# EAGLE design Prototyp-V-0.2 (EAGLE 6.6.0)
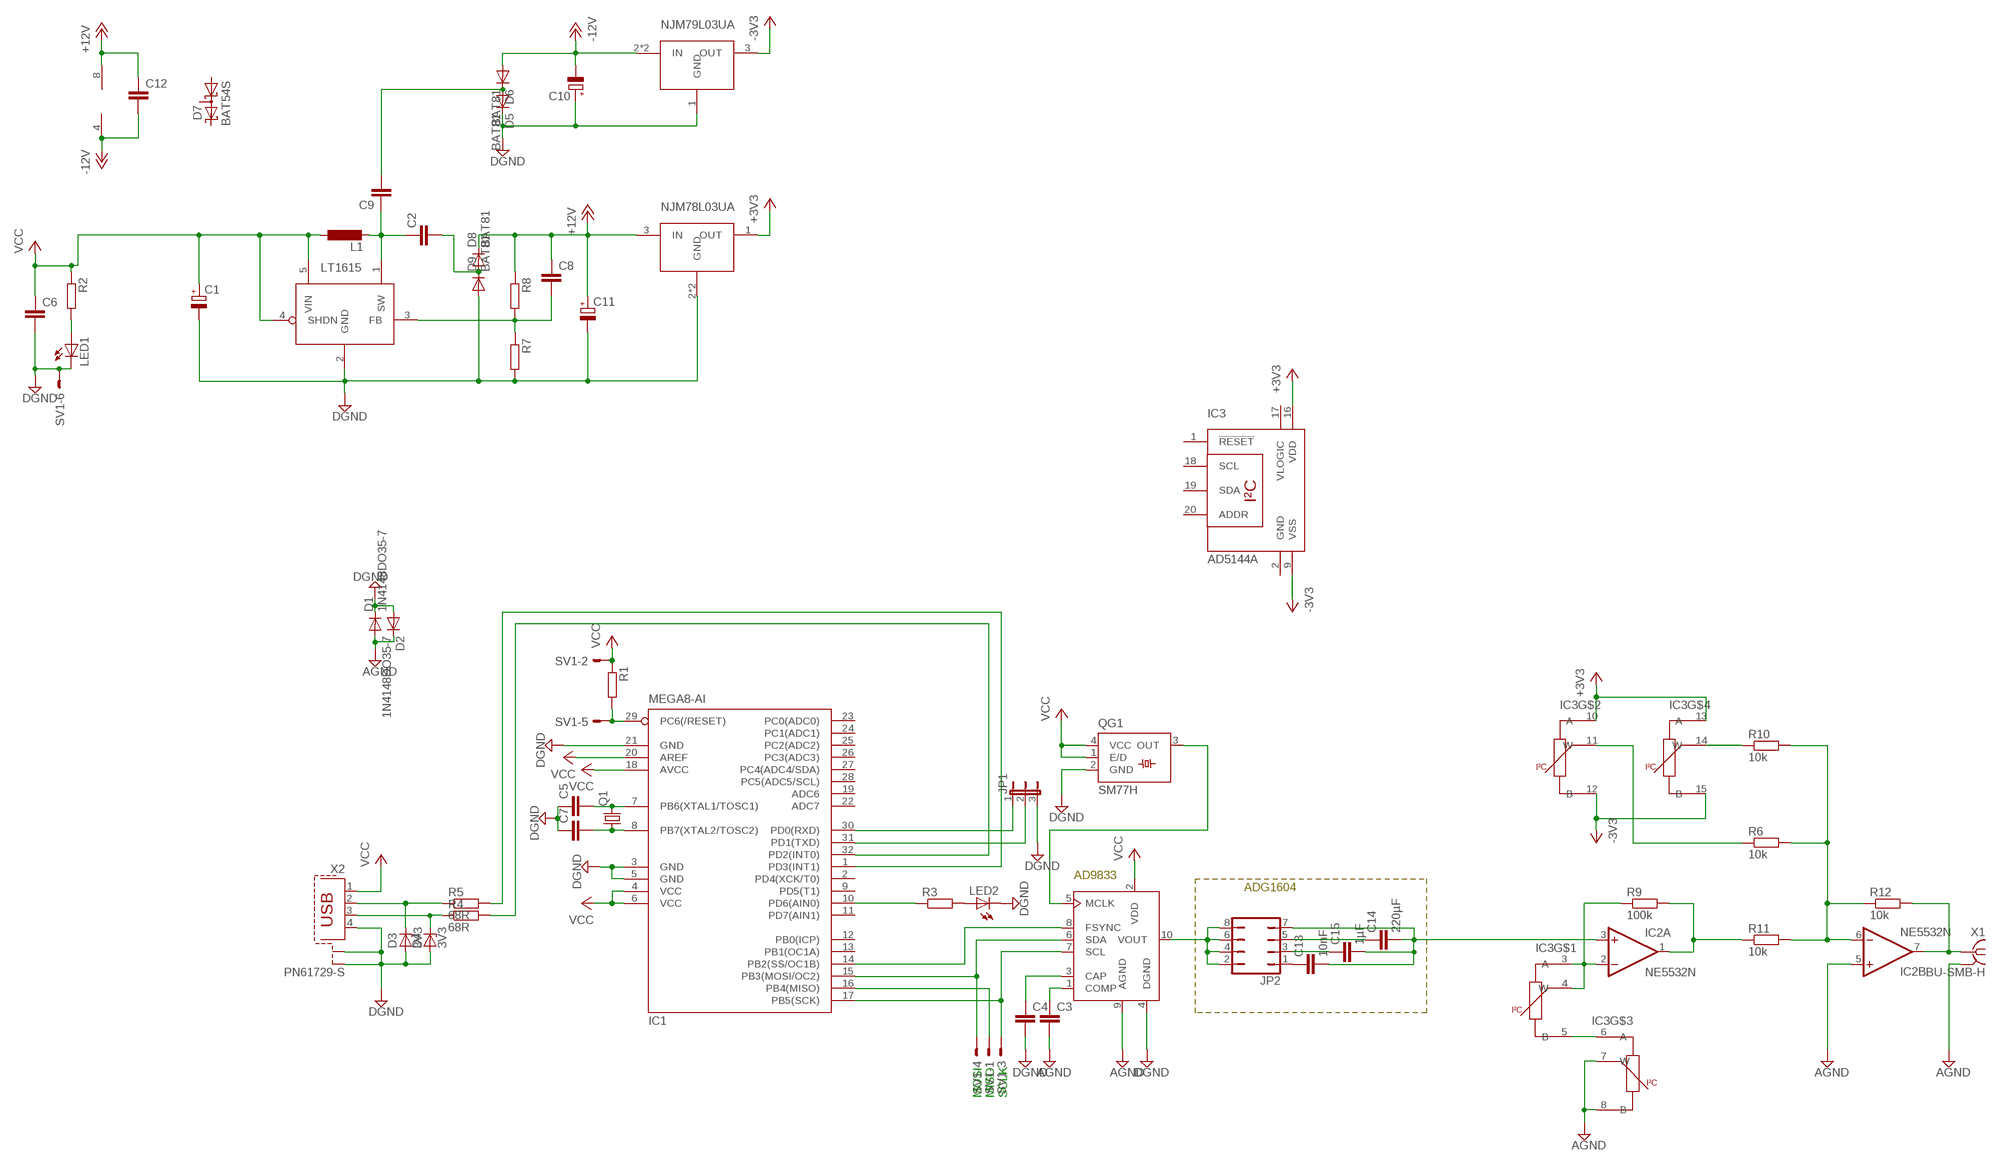
[diagram p0: schematic, sheet 1]

## Parts
C1  CPOL-EUE3.5-8  [E3,5-8]
C2  C-EU025-024X044  [C025-024X044]
C3  C-EU025-024X044  [C025-024X044]
C4  C-EU025-024X044  [C025-024X044]
C5  C-EU025-024X044  [C025-024X044]
C6  C-EU025-024X044  [C025-024X044]
C7  C-EU025-024X044  [C025-024X044]
C8  C-EU025-024X044  [C025-024X044]
C9  C-EU025-024X044  [C025-024X044]
C10  CPOL-EUE3.5-8  [E3,5-8]
C11  CPOL-EUE3.5-8  [E3,5-8]
C12  C-EU025-024X044  [C025-024X044]
C13  10nF  C-EU025-024X044  [C025-024X044]
C14  220µF  C-EU025-024X044  [C025-024X044]
C15  1µF  C-EU025-024X044  [C025-024X044]
D1  1N4148DO35-7  [DO35-7]
D2  1N4148DO35-7  [DO35-7]
D3  3V3  ZENER-DIODEZD-7.5  [ZDIO-7.5]
D4  3V3  ZENER-DIODEZD-7.5  [ZDIO-7.5]
D5  BAT81  [DO34-7]
D6  BAT81  [DO34-7]
D7  BAT54S  [SOT23]
D8  BAT81  [DO34-7]
D9  BAT81  [DO34-7]
IC1  MEGA8-AI  [TQFP32-08]
IC2  NE5532N  [DIL08]
IC3  AD5144A  [TSSOP20]
JP1  JP2E  [JP2]
JP2  JP4Q  [JP4Q]
L1  L-EU0207/10  [0207/10]
LED1  LED5MM  [LED5MM]
LED2  LED5MM  [LED5MM]
Q1  CRYSTALSM77H  [SM77H]
QG1  SM77H  [SM77H]
R1  R-EU_0207/10  [0207/10]
R2  R-EU_0207/10  [0207/10]
R3  R-EU_0207/10  [0207/10]
R4  68R  R-EU_0207/10  [0207/10]
R5  68R  R-EU_0207/10  [0207/10]
R6  10k  R-EU_0207/10  [0207/10]
R7  R-EU_0207/10  [0207/10]
R8  R-EU_0207/10  [0207/10]
R9  100k  R-EU_0207/10  [0207/10]
R10  10k  R-EU_0207/10  [0207/10]
R11  10k  R-EU_0207/10  [0207/10]
R12  10k  R-EU_0207/10  [0207/10]
SV1  ML6E  [ML6]
U$1  AD9833-P  [DIL10]
U$2  LT1615  [SOT23-5]
U$3  NJM79L03UA  [SOT89]
U$4  NJM78L03UA  [SOT89]
X1  BU-SMB-H  [BU-SMB-H]
X2  PN61729-S  [PN61729-S]

## Nets
+3V3: IC3.10(A) IC3.13(A) IC3.16(VDD) U$4.1(OUT)
+12V: C8.1 C11.+ C12.1 D8.C IC2.8(P:V+) R8.1 U$4.3(IN)
-3V3: IC3.9(VSS) IC3.12(B) IC3.15(B) U$3.3(OUT)
-12V: C10.- C12.2 D6.A IC2.4(P:V-) U$3.2(IN) U$3.2@1(IN)
AGND: C3.2 D1.A D2.C IC2.5(B:+IN) IC3.7(W) IC3.8(B) U$1.9(AGND) X1.2 X1.3 X1.4 X1.5
DGND: C1.- C4.2 C5.1 C6.2 C7.1 C10.+ C11.- D1.C D2.A D3.A D4.A D5.C D9.A IC1.3(GND) IC1.5(GND) IC1.21(GND) JP1.3 LED1.K(C) LED2.K(C) QG1.2(GND) R7.2 SV1.6 U$1.4(DGND) U$2.2(GND) U$3.1(GND) U$4.2(GND) U$4.2@1(GND) X2.4 X2.S1 X2.S2
N$1: C5.2 IC1.7(PB6(XTAL1/TOSC1)) Q1.3
N$2: C7.2 IC1.8(PB7(XTAL2/TOSC2)) Q1.1
N$3: C3.1 U$1.1(COMP)
N$4: IC1.17(PB5(SCK)) SV1.3 U$1.7(SCL)
N$5: IC1.29(PC6(/RESET)) R1.2 SV1.5
N$6: IC1.15(PB3(MOSI/OC2)) SV1.4 U$1.6(SDA)
N$7: IC1.14(PB2(SS/OC1B)) U$1.8(FSYNC)
N$8: IC1.16(PB4(MISO)) SV1.1
N$9: C4.1 U$1.3(CAP)
N$10: IC1.10(PD6(AIN0)) R3.1
N$11: QG1.3(OUT) U$1.5(MCLK)
N$12: IC1.32(PD2(INT0)) R4.2
N$13: IC1.1(PD3(INT1)) R5.2
N$14: D3.C R5.1 X2.2
N$15: D4.C R4.1 X2.3
N$16: IC1.30(PD0(RXD)) JP1.1
N$17: LED1.A R2.2
N$18: LED2.A R3.2
N$19: IC1.31(PD1(TXD)) JP1.2
N$20: C8.2 R7.1 R8.2 U$2.3(FB)
N$21: JP2.2 JP2.4 JP2.6 JP2.8 U$1.10(VOUT)
N$22: C9.2 D5.A D6.C
N$23: C2.1 C9.1 L1.2 U$2.1(SW)
N$24: C14.1 JP2.5
N$25: C2.2 D8.A D9.C
N$26: C13.1 JP2.1
N$27: IC2.2(A:-IN) IC3.3(A) IC3.4(W) R9.1
N$28: C13.2 C14.2 C15.2 IC2.3(A:+IN) JP2.7
N$29: IC2.1(A:OUT) R9.2 R11.1
N$30: IC2.6(B:-IN) R6.2 R10.2 R11.2 R12.1
N$31: IC2.7(B:OUT) R12.2 X1.1
N$32: C15.1 JP2.3
N$33: IC3.5(B) IC3.6(A)
N$34: IC3.14(W) R10.1
N$35: IC3.11(W) R6.1
VCC: C1.+ C6.1 IC1.4(VCC) IC1.6(VCC) IC1.18(AVCC) IC1.20(AREF) L1.1 QG1.1(E/D) QG1.4(VCC) R1.1 R2.1 SV1.2 U$1.2(VDD) U$2.4(SHDN) U$2.5(VIN) X2.1
Unconnected: D7.1(A1) D7.2(C2) D7.3(C1A2) IC1.2(PD4(XCK/T0)) IC1.9(PD5(T1)) IC1.11(PD7(AIN1)) IC1.12(PB0(ICP)) IC1.13(PB1(OC1A)) IC1.19(ADC6) IC1.22(ADC7) IC1.23(PC0(ADC0)) IC1.24(PC1(ADC1)) IC1.25(PC2(ADC2)) IC1.26(PC3(ADC3)) IC1.27(PC4(ADC4/SDA)) IC1.28(PC5(ADC5/SCL)) IC3.1(!RESET) IC3.2(GND) IC3.17(VLOGIC) IC3.18(SCL) IC3.19(SDA) IC3.20(ADDR)

## Notes on the sheet
- AD9833
- ADG1604
- MOSI
  MISO
  SCLK

## Library data of the parts
C1 C10 C11 = rcl:CPOL-EU: POLARIZED CAPACITOR, European symbol
C2-C9 C12-C15 = rcl:C-EU: CAPACITOR, European symbol
D1 D2 = diode:1N4148: DIODE high speed (Philips)
D3 D4 = diode:ZENER-DIODE: Z-Diode
D5 D6 D8 D9 = diode:BAT81: DIODE barrier diode
D7 = diode:BAT54S: Schottky Diodes Pin connection corrected 2011-05-04 Source: Fairchild .. BAT54.pdf
IC1 = atmel:MEGA8: MICROCONTROLLER 8 Kbytes FLASH, 1 kbytes SRAM, 512 bytes EEPROM, USART, 6-channel 10 bit ADC, 2-channel 8 bit ADC Pin compatible with Atmega48, ATMega88, ATMega168 Source: avr.lbr; MPN: ATMEGA8-16AU; OC_FARNELL: 9171371; OC_NEWARK: 73M8863
IC2 = linear:NE5532: AUDIO AMPLIFIER
IC3 = analog-devices:AD5144A
JP1 = jumper:JP2E: JUMPER
JP2 = jumper:JP4Q: JUMPER
L1 = rcl:L-EU: INDUCTOR, European symbol
LED1 LED2 = led:LED: LED OSRAM: - CHIPLED LG R971, LG N971, LY N971, LG Q971, LY Q971, LO R971, LY R971 LH N974, LH R974 LS Q976, LO Q976, LY Q976 LO Q996 - Hyper CHIPLED LW Q18S LB Q993, LB Q99A, LB R99A - SideLED LS A670, LO A670, LY A670, LG A670, LP A670 LB A673, LV A673, LT A673, LW A673 LH A674 LY A675 LS A676, LA A676, LO A676, LY A676, LW A676 LS A679, LY A679, LG A679 - Hyper Micro SIDELED® LS Y876, LA Y876, LO Y876, LY Y876 LT Y87S - SmartLED LW L88C, LW L88S LB L89C, LB L89S, LG L890 LS L89K, LO L89K, LY L89K LS L896, LA L896, LO L896, LY L896 - TOPLED LS T670, LO T670, LY T670, LG T670, LP T670 LSG T670, LSP T670, LSY T670, LOP T670, LYG T670 LG T671, LOG T671, LSG T671 LB T673, LV T673, LT T673, LW T673 LH T674 LS T676, LA T676, LO T676, LY T676, LB T676, LH T676, LSB T676, LW T676 LB T67C, LV T67C, LT T67C, LS T67K, LO T67K, LY T67K, LW E67C LS E67B, LA E67B, LO E67B, LY E67B, LB E67C, LV E67C, LT E67C LW T67C LS T679, LY T679, LG T679 LS T770, LO T770, LY T770, LG T770, LP T770 LB T773, LV T773, LT T773, LW T773 LH T774 LS E675, LA E675, LY E675, LS T675 LS T776, LA T776, LO T776, LY T776, LB T776 LHGB T686 LT T68C, LB T68C - Hyper Mini TOPLED® LB M676 - Mini TOPLED Santana® LG M470 LS M47K, LO M47K, LY M47K Source: http://www.osram.convergy.de LUXEON: - LUMILED® LXK2-PW12-R00, LXK2-PW12-S00, LXK2-PW14-U00, LXK2-PW14-V00 LXK2-PM12-R00, LXK2-PM12-S00, LXK2-PM14-U00 LXK2-PE12-Q00, LXK2-PE12-R00, LXK2-PE12-S00, LXK2-PE14-T00, LXK2-PE14-U00 LXK2-PB12-K00, LXK2-PB12-L00, LXK2-PB12-M00, LXK2-PB14-N00, LXK2-PB14-P00, LXK2-PB14-Q00 LXK2-PR12-L00, LXK2-PR12-M00, LXK2-PR14-Q00, LXK2-PR14-R00 LXK2-PD12-Q00, LXK2-PD12-R00, LXK2-PD12-S00 LXK2-PH12-R00, LXK2-PH12-S00 LXK2-PL12-P00, LXK2-PL12-Q00, LXK2-PL12-R00 Source: www.luxeon.com KINGBRIGHT: KA-3528ASYC Source: www.kingbright.com
Q1 = crystal:CRYSTAL: CRYSTAL
QG1 = crystal:SM77H: 3.3V CMOS Clock Oscillator Source: www.pletronics.com .. sm77h%203.3v.pdf; OC_FARNELL: unknown; OC_NEWARK: unknown
R1-R12 = rcl:R-EU_: RESISTOR, European symbol
SV1 = con-harting-ml:ML6?E: HARTING; OC_FARNELL: unknown; OC_NEWARK: unknown
U$1 = analog-devices:AD9833: AD9833 DDS-IC Information: analog.com
U$2 = linear:LT1615
U$3 U$4 = linear:NJM7
X1 = con-coax:BU-SMB-H: FEMALE SMB CONNECTOR Radiall distributor RS 112-3003; OC_FARNELL: unknown; OC_NEWARK: unknown
X2 = con-berg:PN61729-S: BERG USB connector; OC_FARNELL: unknown; OC_NEWARK: unknown

## Board
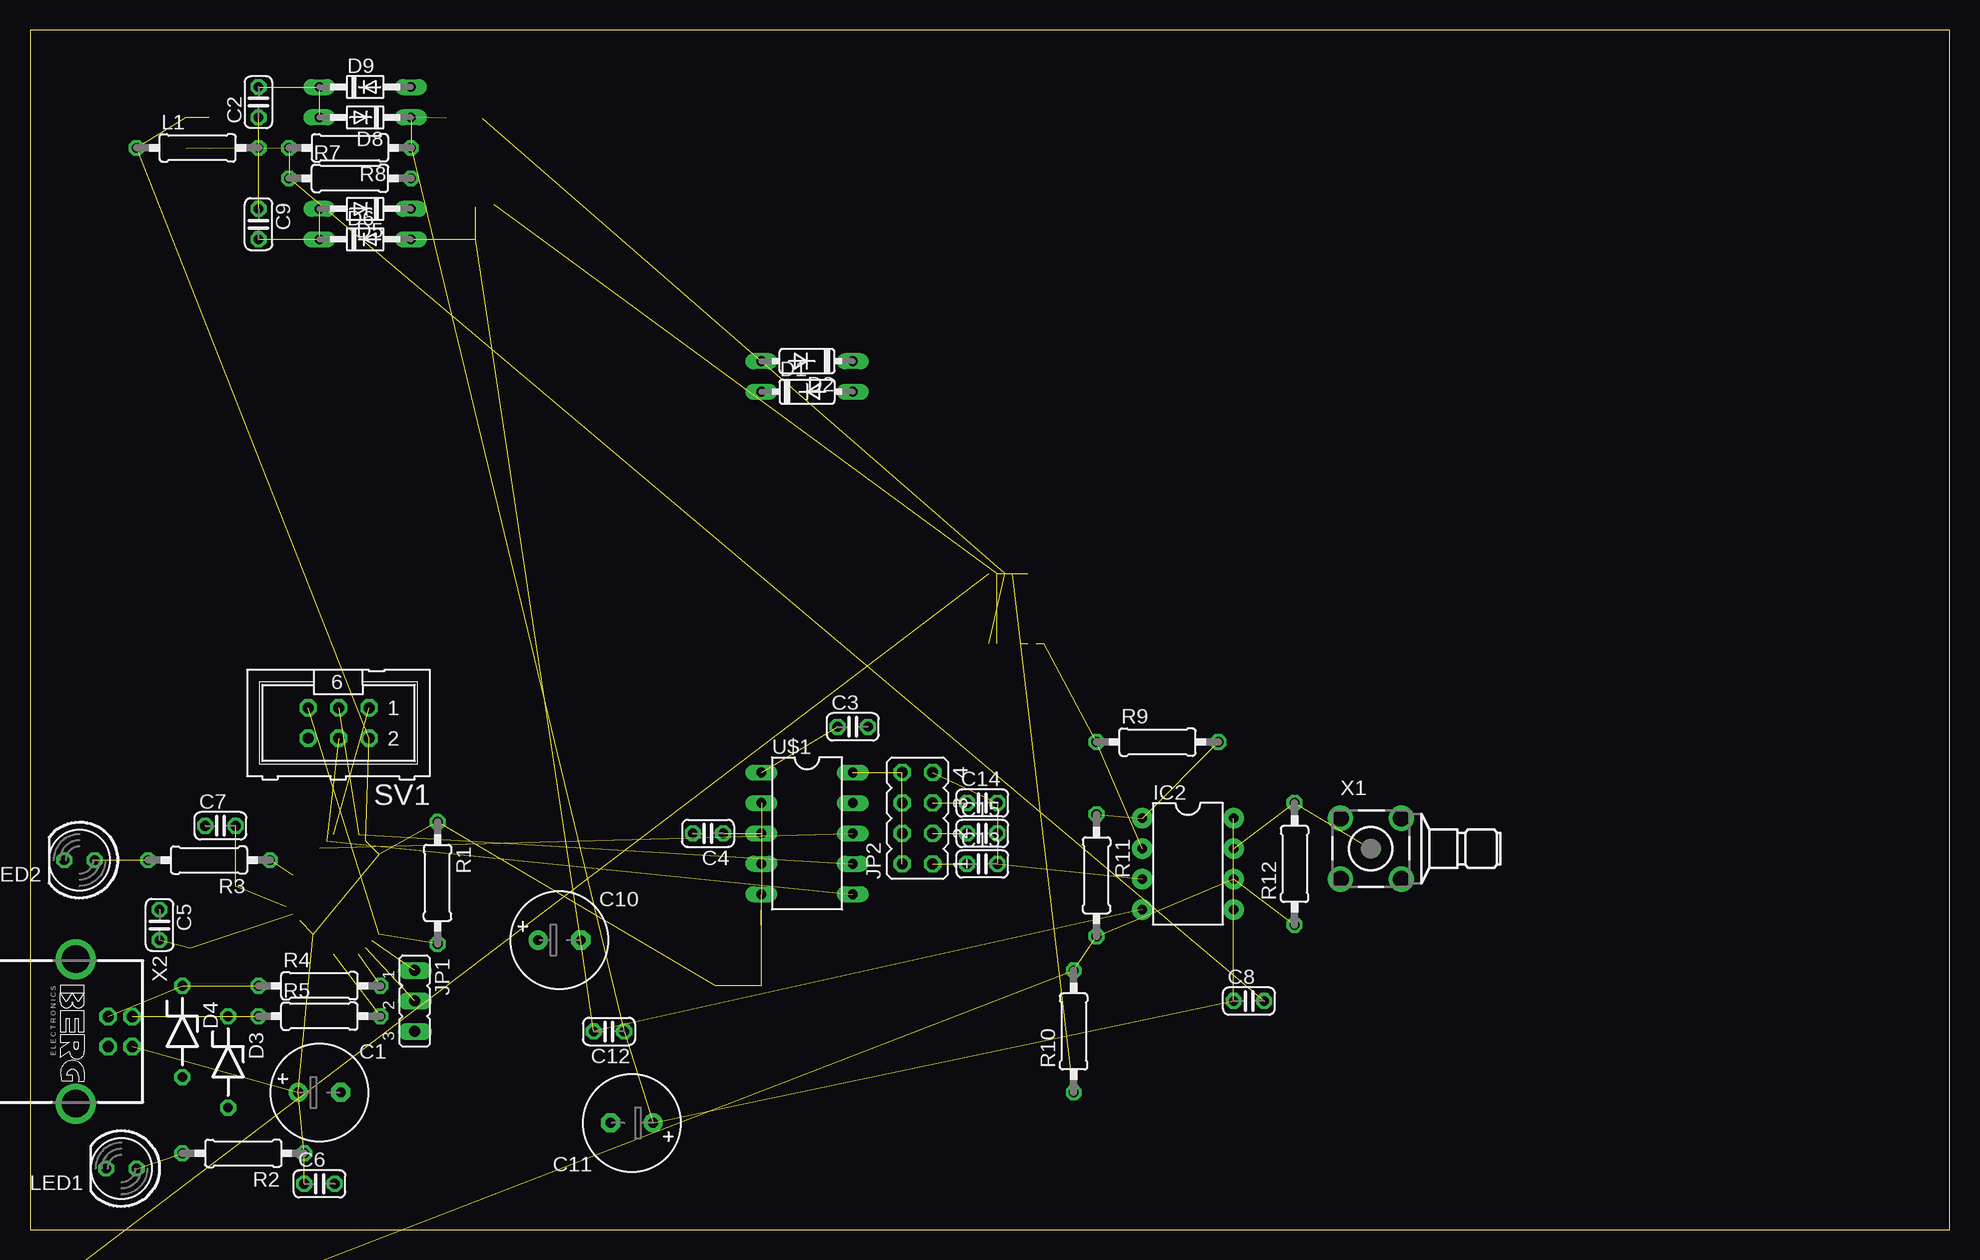
[diagram p1: board, top side]
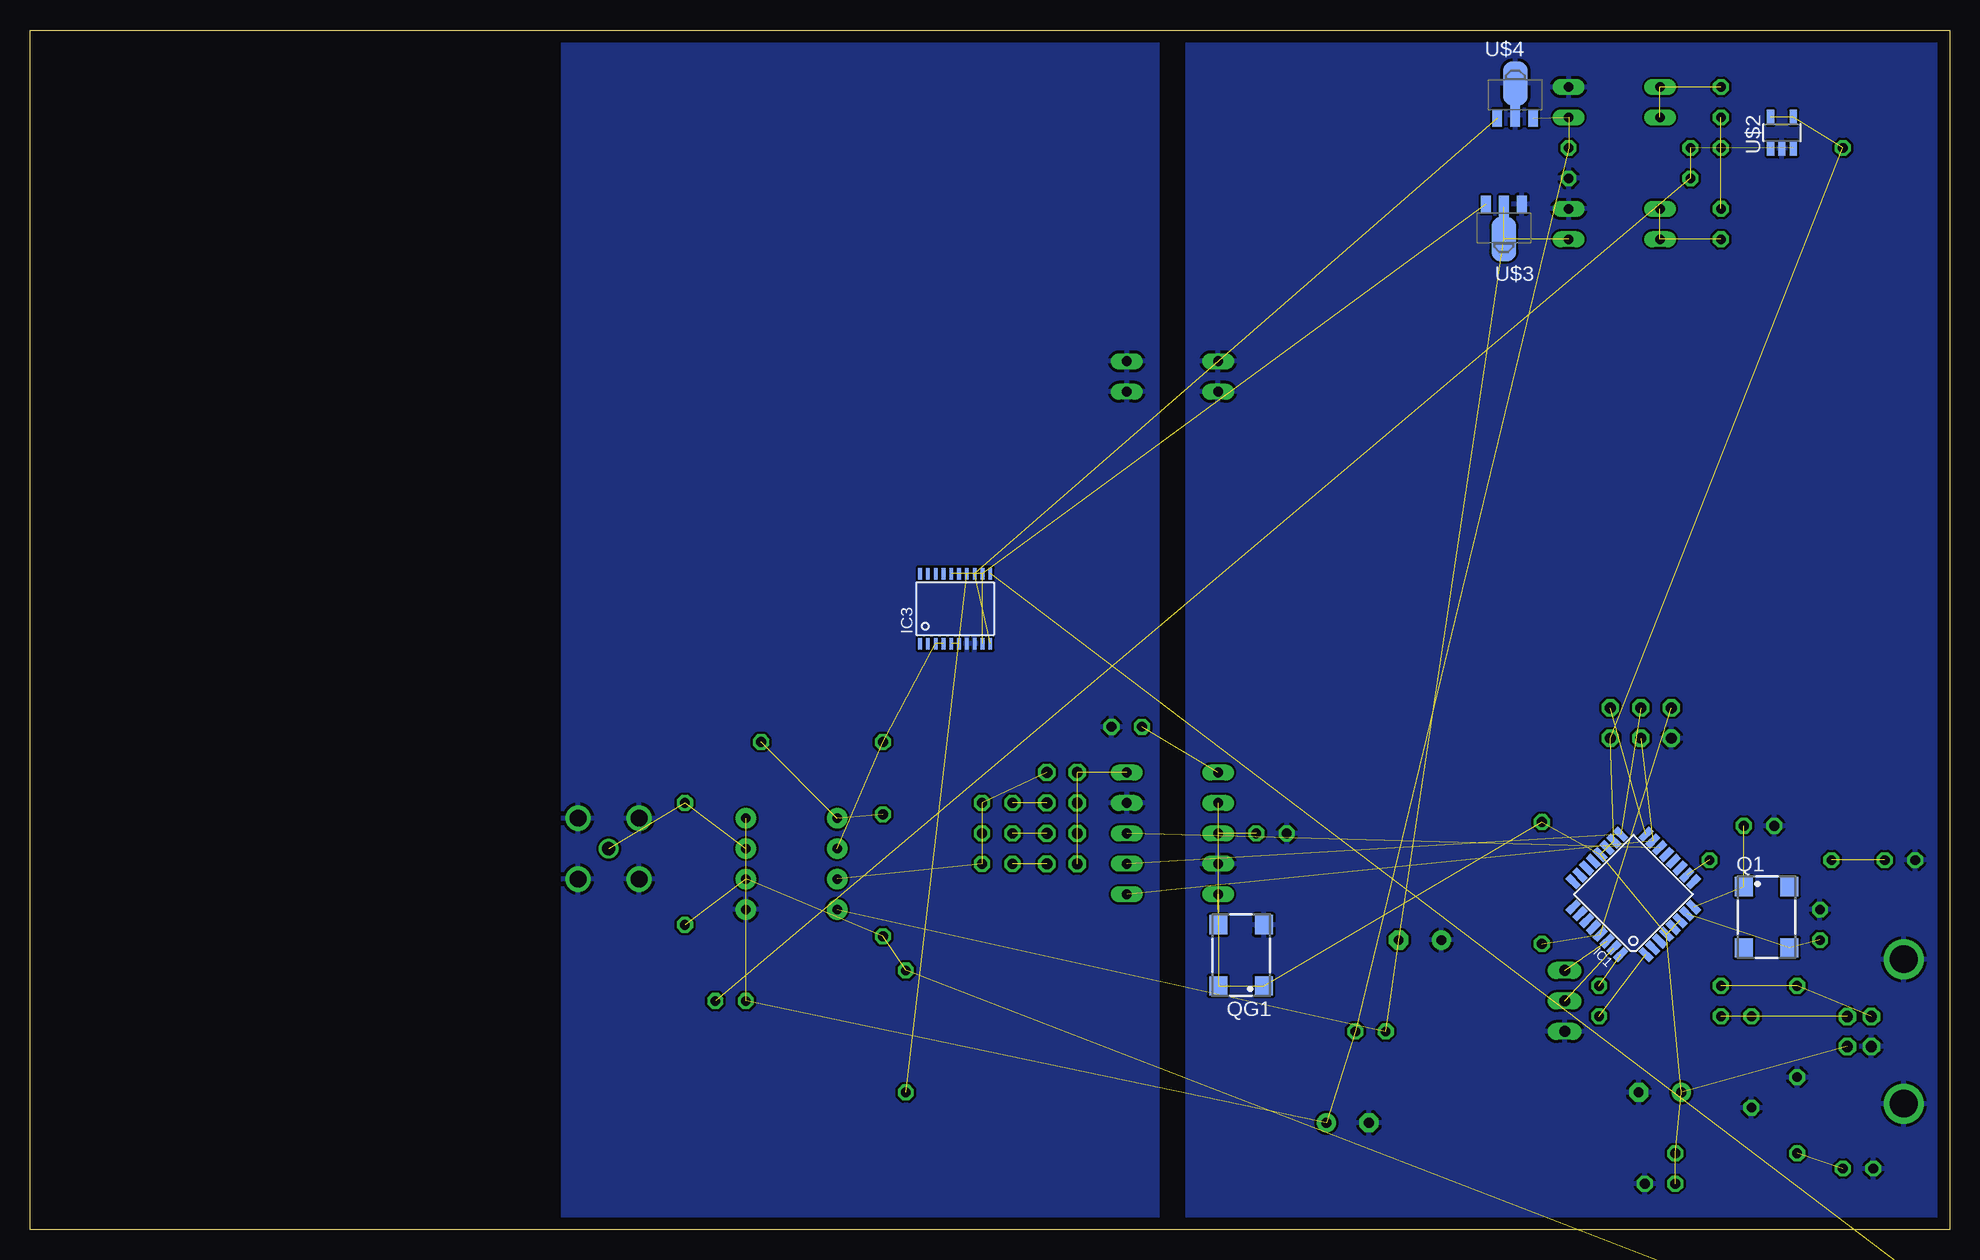
[diagram p2: board, bottom side, seen from below]

Size 160 x 100 mm. Coordinates in mm from the lower left corner, seen from the top.
Outline: 0,0 160,0 160,100 0,100 0,0
Copper layers (1*16): Top 0.035mm / dielectric 1.5mm / Bottom 0.035mm
Design rules "default": minimum track width 10mil, minimum drill 24mil, track to track 8mil, track to pad 8mil, pad to pad 8mil, via to via 8mil, smd to smd 8mil, copper to edge 40mil, drill to drill 8mil, minimum pad ring 10mil, minimum via ring 8mil, stop-mask expansion 4mil, vias tented up to drill 0mil, thermal gap 10mil

### Footprints (pad centres in the part's own frame; a part is rotated, then mirrored left to right if it is on the bottom)
E3,5-8 = drill 0.813 pad 1.6: + -1.778,0 | drill 0.813 pad 1.6 octagon: - 1.778,0
C025-024X044 = drill 0.813 octagon: 1 -1.27,0; 2 1.27,0
DO35-7 = drill 0.813 long: A 3.81,0; C -3.81,0
ZDIO-7.5 = drill 0.813 octagon: A 3.81,0; C -3.81,0
DO34-7 = drill 0.813 long: A 3.81,0; C -3.81,0
SOT23 = smd 1 x 1.4: 1 -0.95,-1.1; 2 0.95,-1.1; 3 0,1.1
TQFP32-08 = smd 1.27 x 0.559: 1 -4.293,2.8; 2 -4.293,2; 3 -4.293,1.2; 4 -4.293,0.4; 5 -4.293,-0.4; 6 -4.293,-1.2; 7 -4.293,-2; 8 -4.293,-2.8; 17 4.293,-2.8; 18 4.293,-2; 19 4.293,-1.2; 20 4.293,-0.4; 21 4.293,0.4; 22 4.293,1.2; 23 4.293,2; 24 4.293,2.8 | smd 0.559 x 1.27: 9 -2.8,-4.293; 10 -2,-4.293; 11 -1.2,-4.293; 12 -0.4,-4.293; 13 0.4,-4.293; 14 1.2,-4.293; 15 2,-4.293; 16 2.8,-4.293; 25 2.8,4.293; 26 2,4.293; 27 1.2,4.293; 28 0.4,4.293; 29 -0.4,4.293; 30 -1.2,4.293; 31 -2,4.293; 32 -2.8,4.293
DIL08 = drill 0.813 pad 1.676: 1 -3.81,-3.81; 2 -1.27,-3.81; 3 1.27,-3.81; 4 3.81,-3.81; 5 3.81,3.81; 6 1.27,3.81; 7 -1.27,3.81; 8 -3.81,3.81
TSSOP20 = smd 0.305 x 0.991: 1 -3.575,-2.918; 2 -2.925,-2.918; 3 -2.275,-2.918; 4 -1.625,-2.918; 5 -0.975,-2.918; 6 -0.325,-2.918; 7 0.325,-2.918; 8 0.975,-2.918; 9 1.625,-2.918; 10 2.275,-2.918; 11 2.275,2.918; 12 1.625,2.918; 13 0.975,2.918; 14 0.325,2.918; 15 -0.325,2.918; 16 -0.975,2.918; 17 -1.625,2.918; 18 -2.275,2.918; 19 -2.925,2.918; 20 -3.575,2.918
JP2 = drill 0.914 long: 1 -2.54,0; 2 0,0; 3 2.54,0
JP4Q = drill 0.914 octagon: 1 -3.81,-1.27; 2 -3.81,1.27; 3 -1.27,-1.27; 4 -1.27,1.27; 5 1.27,-1.27; 6 1.27,1.27; 7 3.81,-1.27; 8 3.81,1.27
0207/10 = drill 0.813 octagon: 1 -5.08,0; 2 5.08,0
LED5MM = drill 0.813 octagon: A -1.27,0; K 1.27,0
SM77H = smd 1.6 x 1.5: 1 -2.55,-1.9; 2 2.55,-1.9; 3 2.55,1.9; 4 -2.55,1.9
ML6 = drill 0.914 octagon: 1 -2.54,-1.27; 2 -2.54,1.27; 3 0,-1.27; 4 0,1.27; 5 2.54,-1.27; 6 2.54,1.27
DIL10 = drill 0.813 long: 1 -5.08,-3.81; 2 -2.54,-3.81; 3 0,-3.81; 4 2.54,-3.81; 5 5.08,-3.81; 6 5.08,3.81; 7 2.54,3.81; 8 0,3.81; 9 -2.54,3.81; 10 -5.08,3.81
SOT23-5 = smd 0.6 x 1.2: 1 -0.95,-1.306; 2 0,-1.306; 3 0.95,-1.306; 4 0.95,1.306; 5 -0.95,1.306
SOT89 = smd 0.8 x 1.4: 1 -1.499,-1.981; 3 1.499,-1.981 | smd 0.8 x 1.9: 2 0,-1.727 | smd 2.032 x 3.65: 2@1 0,0.94
BU-SMB-H = drill 1.1: 1 0,0 | drill 1.4: 2 -2.54,2.54; 3 2.54,2.54; 4 2.54,-2.54; 5 -2.54,-2.54
PN61729-S = drill 0.95 octagon: 1 1.25,4.71; 2 -1.25,4.71; 3 -1.25,2.71; 4 1.25,2.71 | drill 2.3 pad 2.9: S1 -6.02,0; S2 6.02,0

### Placement (x,y rotation side)
C1  24.13,11.43 0 top
C2  19.05,93.98 90 top
C3  68.58,41.91 0 top
C4  56.52,33.02 180 top
C5  10.79,25.4 270 top
C6  24.13,3.81 0 top
C7  15.88,33.66 0 top
C8  101.6,19.05 0 top
C9  19.05,83.82 270 top
C10  44.13,24.13 0 top
C11  50.16,8.89 180 top
C12  48.26,16.51 180 top
C13  79.38,30.48 0 top
C14  79.38,35.56 0 top
C15  79.38,33.02 0 top
D1  64.77,69.85 0 top
D2  64.77,72.39 180 top
D3  16.51,13.97 270 top
D4  12.7,16.51 270 top
D5  27.94,85.09 180 top
D6  27.94,82.55 0 top
D7  -4.13,-3.17 0 top  (outside the outline)
D8  27.94,92.71 180 top
D9  27.94,95.25 0 top
IC1  26.35,27.94 135 bottom
IC2  96.52,30.48 270 top
IC3  82.23,51.75 0 bottom
JP1  32.07,19.05 270 top
JP2  73.98,34.29 90 top
L1  13.97,90.17 0 top
LED1  7.62,5.08 180 top
LED2  4.13,30.8 180 top
Q1  15.24,26.04 270 bottom
QG1  59.05,22.86 90 bottom
R1  33.97,28.89 270 top
R2  17.78,6.35 180 top
R3  14.92,30.8 180 top
R4  24.13,20.32 0 top
R5  24.13,17.78 0 top
R6  -0.32,-10.16 0 top  (outside the outline)
R7  26.67,87.63 0 top
R8  26.67,90.17 180 top
R9  93.98,40.64 0 top
R10  87,16.51 90 top
R11  88.9,29.53 270 top
R12  105.41,30.48 90 top
SV1  25.72,42.23 180 top
U$1  64.77,33.02 270 top
U$2  13.97,91.44 0 bottom
U$3  37.15,83.5 180 bottom
U$4  36.2,94.61 0 bottom
X1  111.76,31.75 0 top
X2  3.81,16.51 270 top

### Tracks (layer width: path | path; a pad name or v marks a point on that pad's centre or on a via)
+3V3  (3 unrouted)
+12V  (6 unrouted)
-3V3  (3 unrouted)
-12V  (5 unrouted)
AGND
  pour Bottom: 66.04,0 66.04,100.33 115.57,100.33 115.57,0
DGND
  pour Bottom: 0,0 63.5,0 63.5,100.33 0,100.33
N$1  (2 unrouted)
N$2  (2 unrouted)
N$3  (1 unrouted)
N$4  (2 unrouted)
N$5  (2 unrouted)
N$6  (2 unrouted)
N$7  (1 unrouted)
N$8  (1 unrouted)
N$9  (1 unrouted)
N$10  (1 unrouted)
N$11  (1 unrouted)
N$12  (1 unrouted)
N$13  (1 unrouted)
N$14  (2 unrouted)
N$15  (2 unrouted)
N$16  (1 unrouted)
N$17  (1 unrouted)
N$18  (1 unrouted)
N$19  (1 unrouted)
N$20  (3 unrouted)
N$21  (4 unrouted)
N$22  (2 unrouted)
N$23  (3 unrouted)
N$24  (1 unrouted)
N$25  (2 unrouted)
N$26  (1 unrouted)
N$27  (3 unrouted)
N$28  (4 unrouted)
N$29  (2 unrouted)
N$30  (4 unrouted)
N$31  (2 unrouted)
N$32  (1 unrouted)
N$33  (1 unrouted)
N$34  (1 unrouted)
N$35  (1 unrouted)
VCC  (15 unrouted)